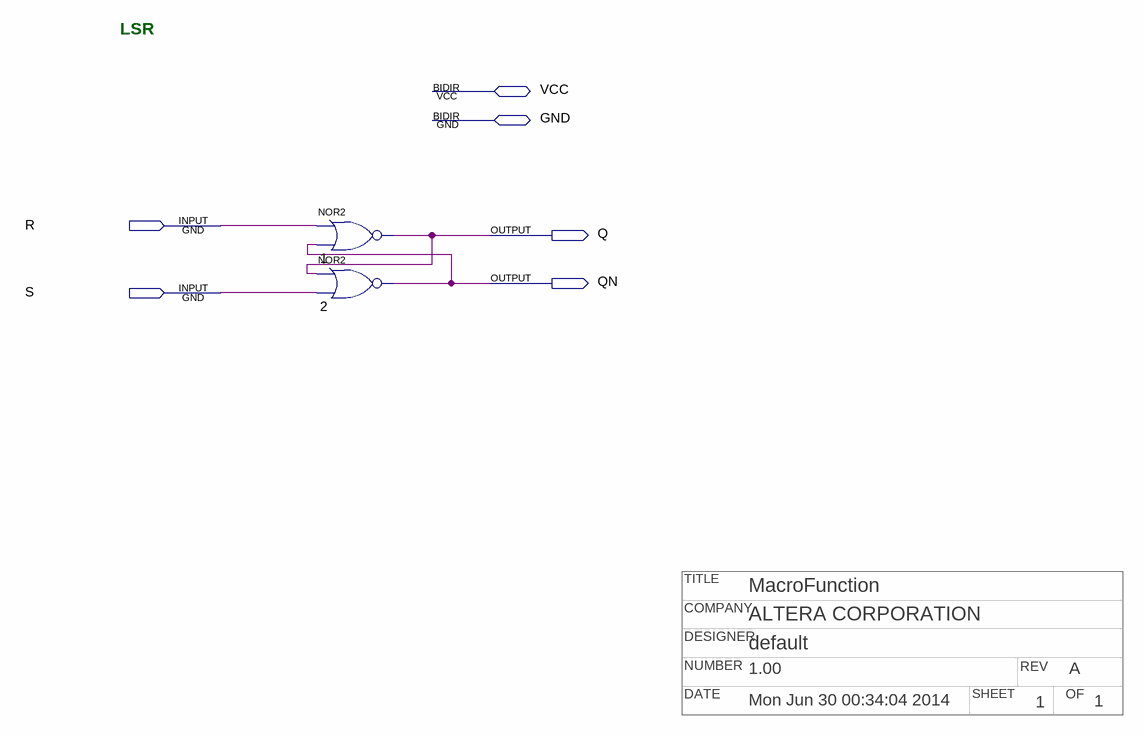
[diagram p0: schematic sheet]
// Quartus schematic nplsr.bdf as structural Verilog: 2 symbols, 6 pins
// Title block: TITLE: MacroFunction; COMPANY: ALTERA CORPORATION; DESIGNER: default; NUMBER: 1.00; REV: A; DATE: Mon Jun 30 00:34:04 2014; SHEET: 1; OF: 1
module nplsr (
  input  R,
  input  S,
  inout  VCC,
  inout  GND,
  output Q,
  output QN
);

  nor u_1 (Q, R, QN);
  nor u_2 (QN, Q, S);

  // Notes on the sheet:
  //   LSR
endmodule
